# Altium schematic sheet Magnetic_Encoder.SchDoc: Magnetic Encoder
size OrCAD A
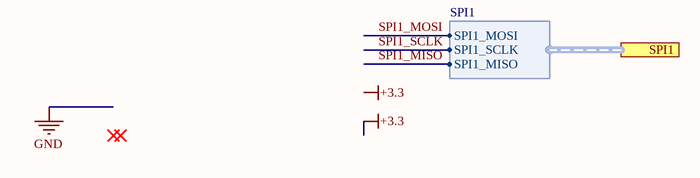
[diagram p0: Magnetic_Encoder.SchDoc]

## Ports
SPI1 (harness SPI1)

## Harnesses
SPI1: SPI1_MISO, SPI1_MOSI, SPI1_SCLK

## Nets
SPI1_MISO: port SPI1.SPI1_MISO
SPI1_MOSI: port SPI1.SPI1_MOSI
SPI1_SCLK: port SPI1.SPI1_SCLK

## Notes on the sheet
- Labels drawn without touching a wire or pin: +3.3
- Title
- Size:
- Date:
- Orcad A
- Number:
- Time:
- Revision:
- Sheet
- of
- ZLS Corporation
- 7801 North Lamar Blvd.
- Suite E-184
- Austin, Texas 78752  USA
- (512) 453-0288
- File: